# Altium schematic sheet Sheet1_ESP32_Blynh.SchDoc
size A3; SheetNumber: 1; SheetTotal: 1
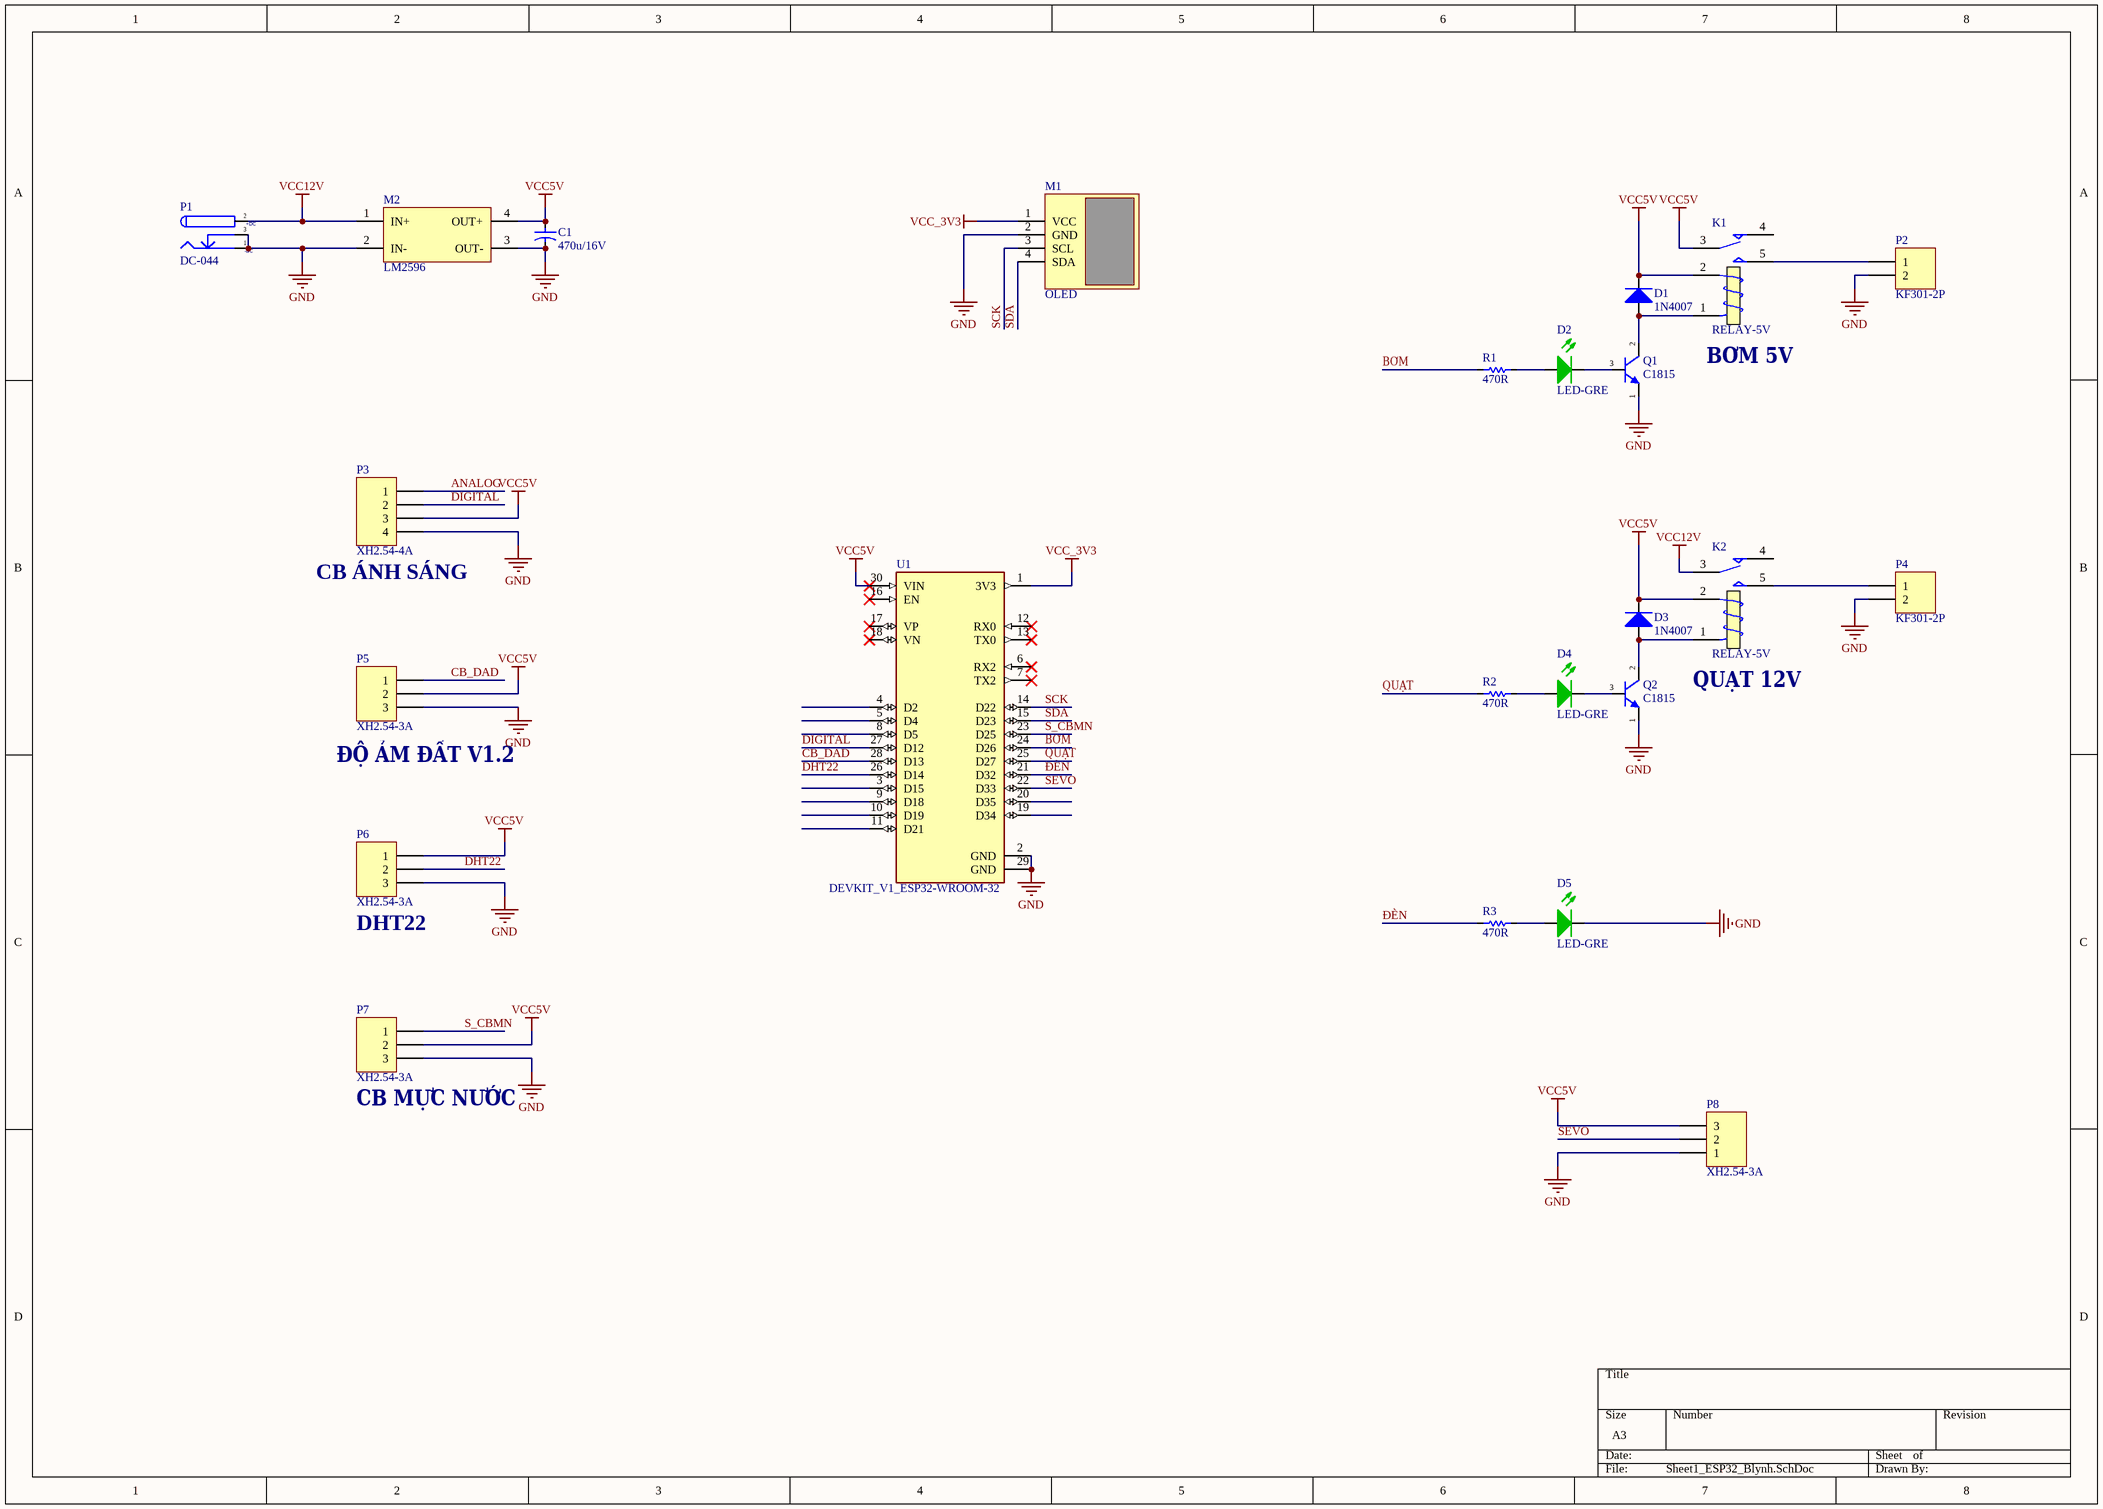
[diagram p0: Sheet1_ESP32_Blynh.SchDoc]

## Parts
C1  470u/16V  [CAP 8x12x3.5]
D1  1N4007  [DO41-300MIL]
D2  LED-GRE  [LED-3MM-G]
D3  1N4007  [DO41-300MIL]
D4  LED-GRE  [LED-3MM-G]
D5  LED-GRE  [LED-3MM-G]
K1  RELAY-5V  [RELAY 12V_112D1]
K2  RELAY-5V  [RELAY 12V_112D1]
M1  OLED  [OLED 0.96 I2C]
M2  LM2596  [LM2596 Module]
P1  DC-044  [JACK DC 5.5-044]
P2  KF301-2P  [KF301-2P]
P3  XH2.54-4A  [XH2.54-4A]
P4  KF301-2P  [KF301-2P]
P5  XH2.54-3A  [XH2.54-3A]
P6  XH2.54-3A  [XH2.54-3A]
P7  XH2.54-3A  [XH2.54-3A]
P8  XH2.54-3A  [XH2.54-3A]
Q1  C1815  [TO-92]
Q2  C1815  [TO-92]
R1  470R  [R-300mil]
R2  470R  [R-300mil]
R3  470R  [R-300mil]
U1  DEVKIT_V1_ESP32-WROOM-32  [MODULE_DEVKIT_V1_ESP32-WROOM-32]

## Nets
GND: C1.2 D5.2(K) M1.2(GND) M2.2(IN-) M2.3(OUT-) P1.1 P1.3 P2.2 P3.4 P4.2 P5.3 P6.3 P7.3 P8.1 Q1.1(E) Q2.1(E) U1.2(GND) U1.29(GND)
VCC5V: C1.1 D1.2(K) D3.2(K) K1.2(T1) K1.3(COM) K2.2(T1) M2.4(OUT+) P3.3 P5.2 P6.1 P7.2 P8.3 U1.30(VIN)
VCC12V: K2.3(COM) M2.1(IN+) P1.2
VCC_3V3: M1.1(VCC) U1.1(3V3)
ANALOG: P3.1
BƠM: R1.2 U1.24(D26)
CB_DAD: P5.1 U1.28(D13)
DHT22: P6.2 U1.26(D14)
DIGITAL: P3.2 U1.27(D12)
QUẠT: R2.2 U1.25(D27)
S_CBMN: P7.1 U1.23(D25)
SCK: M1.3(SCL) U1.14(D22)
SDA: M1.4(SDA) U1.15(D23)
SEVO: P8.2 U1.22(D33)
ĐÈN: R3.2 U1.21(D32)
NetD1_1: D1.1(A) K1.1(T2) Q1.2(C)
NetD2_1: D2.1(A) R1.1
NetD2_2: D2.2(K) Q1.3(B)
NetD3_1: D3.1(A) K2.1(T2) Q2.2(C)
NetD4_1: D4.1(A) R2.1
NetD4_2: D4.2(K) Q2.3(B)
NetD5_1: D5.1(A) R3.1
NetK1_5: K1.5(NO) P2.1
NetK2_5: K2.5(NO) P4.1

Not connected (* = marked no-connect by the designer): K1 4(NC); K2 4(NC); U1 3(D15) 4(D2) 5(D4) 6(RX2)* 7(TX2)* 8(D5) 9(D18) 10(D19) 11(D21) 12(RX0)* 13(TX0)* 16(EN)* 17(VP)* 18(VN)* 19(D34) 20(D35)

## Notes on the sheet
- (near K1) BƠM 5V
- (near P3) CB ÁNH SÁNG
- (near K2) QUẠT 12V
- (near P5) ĐỘ ẢM ĐẤT V1.2
- (near P6) DHT22
- (near P7) CB MỰC NƯỚC
- (in symbol JACK DC-044) +DC; -DC

## Library data of the parts
C1 = 470u/16V (8x12.5x3.5): 470µF 16V Aluminum Capacitors Radial, Can 3000 Hrs @ 105°C; SAPO_NAME: Tụ phân cực 470uF 16V; SAPO_CODE: 510750; Mounting_Type: Through_Hole; Value: 470uF/16V; Parameter 1: *; Parameter 2: *
D1 D3 = 1N4007 DO41: 1A 1000V Diode Standard; Mounting_Type: Through_Hole; SAPO_CODE: 260180; SAPO_NAME: 1N4007 DIP(DO-41); Value: 1N4007 DO-41; Price: 200; Processing Cost: *
D2 D4 D5 = LED-3MM-RED-LENS_GREEN: Mounting_Type: Through_Hole; SAPO_NAME: LED 3mm Xanh lá (Có màu); SAPO_CODE: 140150; Value: LED-GRE 3mm; Processing Cost: *; Price: *
K1 K2 = Relay SONGLE SRD-12VDC-SL-C 12V-10A(Type1): SAPO_NAME: Relay SONGLE SRD-12VDC-SL-C 12V (10A - 5 chân); SAPO_CODE: 440120; Mounting_Type: Through_Hole; Value: RELAY 12V 10A; Price: 6000; ComponentLink1Description: linhkienviet; ComponentLink1URL: http://linhkienviet.vn/relay-songle-srd-12vdc-sl-c-12v-10a-5-chan
M1 = OLED 0.96 I2C: Mounting_Type: *; Price: *; Processing Cost: *; SAPO_CODE: *; SAPO_NAME: *; Value: *; ComponentLink1Description: Supplier; ComponentLink1URL: www.www.www; ComponentLink2Description: Document; ComponentLink2URL: www.www.wwww
M2 = LM2596 Buck Module
P1 = JACK DC-044: JACK DC 044 5.5 2.1; SAPO_CODE: 202290; SAPO_NAME: Chân nguồn DC-044 DC CÁI 5.5-2.1; Mounting_Type: Through_Hole; Value: DC-044; Price: 2000; Processing Cost: *; ComponentLink1Description: linhkienviet; ComponentLink1URL: http://linhkienviet.vn/chan-nguon-dc-044-dc-cai-5-5-2-1
P2 P4 = KF301-2P: Mounting_Type: Through_Hole; SAPO_CODE: 205300; SAPO_NAME: Header KF301-2p 5.08mm chân tròn; Value: KF301-2P
P3 = XH2.54-4A: Mounting_Type: Through_Hole; SAPO_CODE: 201190; SAPO_NAME: Xh2.54-4A Đực 4 chân thẳng; Value: XH2.54-4A; Price: 250; ComponentLink1Description: linhkienviet; ComponentLink1URL: http://linhkienviet.vn/xh2-54-4a-duc-4-chan-thang
P5-P8 = XH2.54-3A: Mounting_Type: Through_Hole; SAPO_CODE: 201170; SAPO_NAME: XH2.54-3A Đực 3 chân thẳng; Value: XH2.54-3A; Price: 250; ComponentLink1Description: linhkienviet; ComponentLink1URL: http://linhkienviet.vn/xh2-54-3a-duc-3-chan-thang
Q1 Q2 = C1815-TO92: TRANS NPN 50V 0.15A TO-92; SAPO_CODE: 490220; SAPO_NAME: C1815 TO-92; Mounting_Type: Through_Hole; Value: C1815 TO-92; Price: 350; Processing Cost: *; ComponentLink1Description: linhkienviet; ComponentLink1URL: http://linhkienviet.vn/c1815-to-92
R1-R3 = R 1/4W 5%: RES xxx OHM 1/4W 5% CARBON FILM; Mounting_Type: Through_Hole; SAPO_NAME: Resistor 1/4W 5%; SAPO_CODE: *; Processing Cost: *; Price: 40; Value: 1/4W
U1 = DEVKIT_V1_ESP32-WROOM-32: WROOM-32 Development Board ESP32 ESP-32S WiFi Bluetooth Dev Module; MF: Do it; MP: DEVKIT V1 ESP32-WROOM-32; SnapEDA_Link: https://www.snapeda.com/parts/DEVKIT%20V1%20ESP32-WROOM-32/Do+it/view-part/?ref=snap; Package: Package; Value: *; Check_prices: https://www.snapeda.com/parts/DEVKIT%20V1%20ESP32-WROOM-32/Do+it/view-part/?ref=eda